# EAGLE schematic repeater_opto (EAGLE 8.4.1)
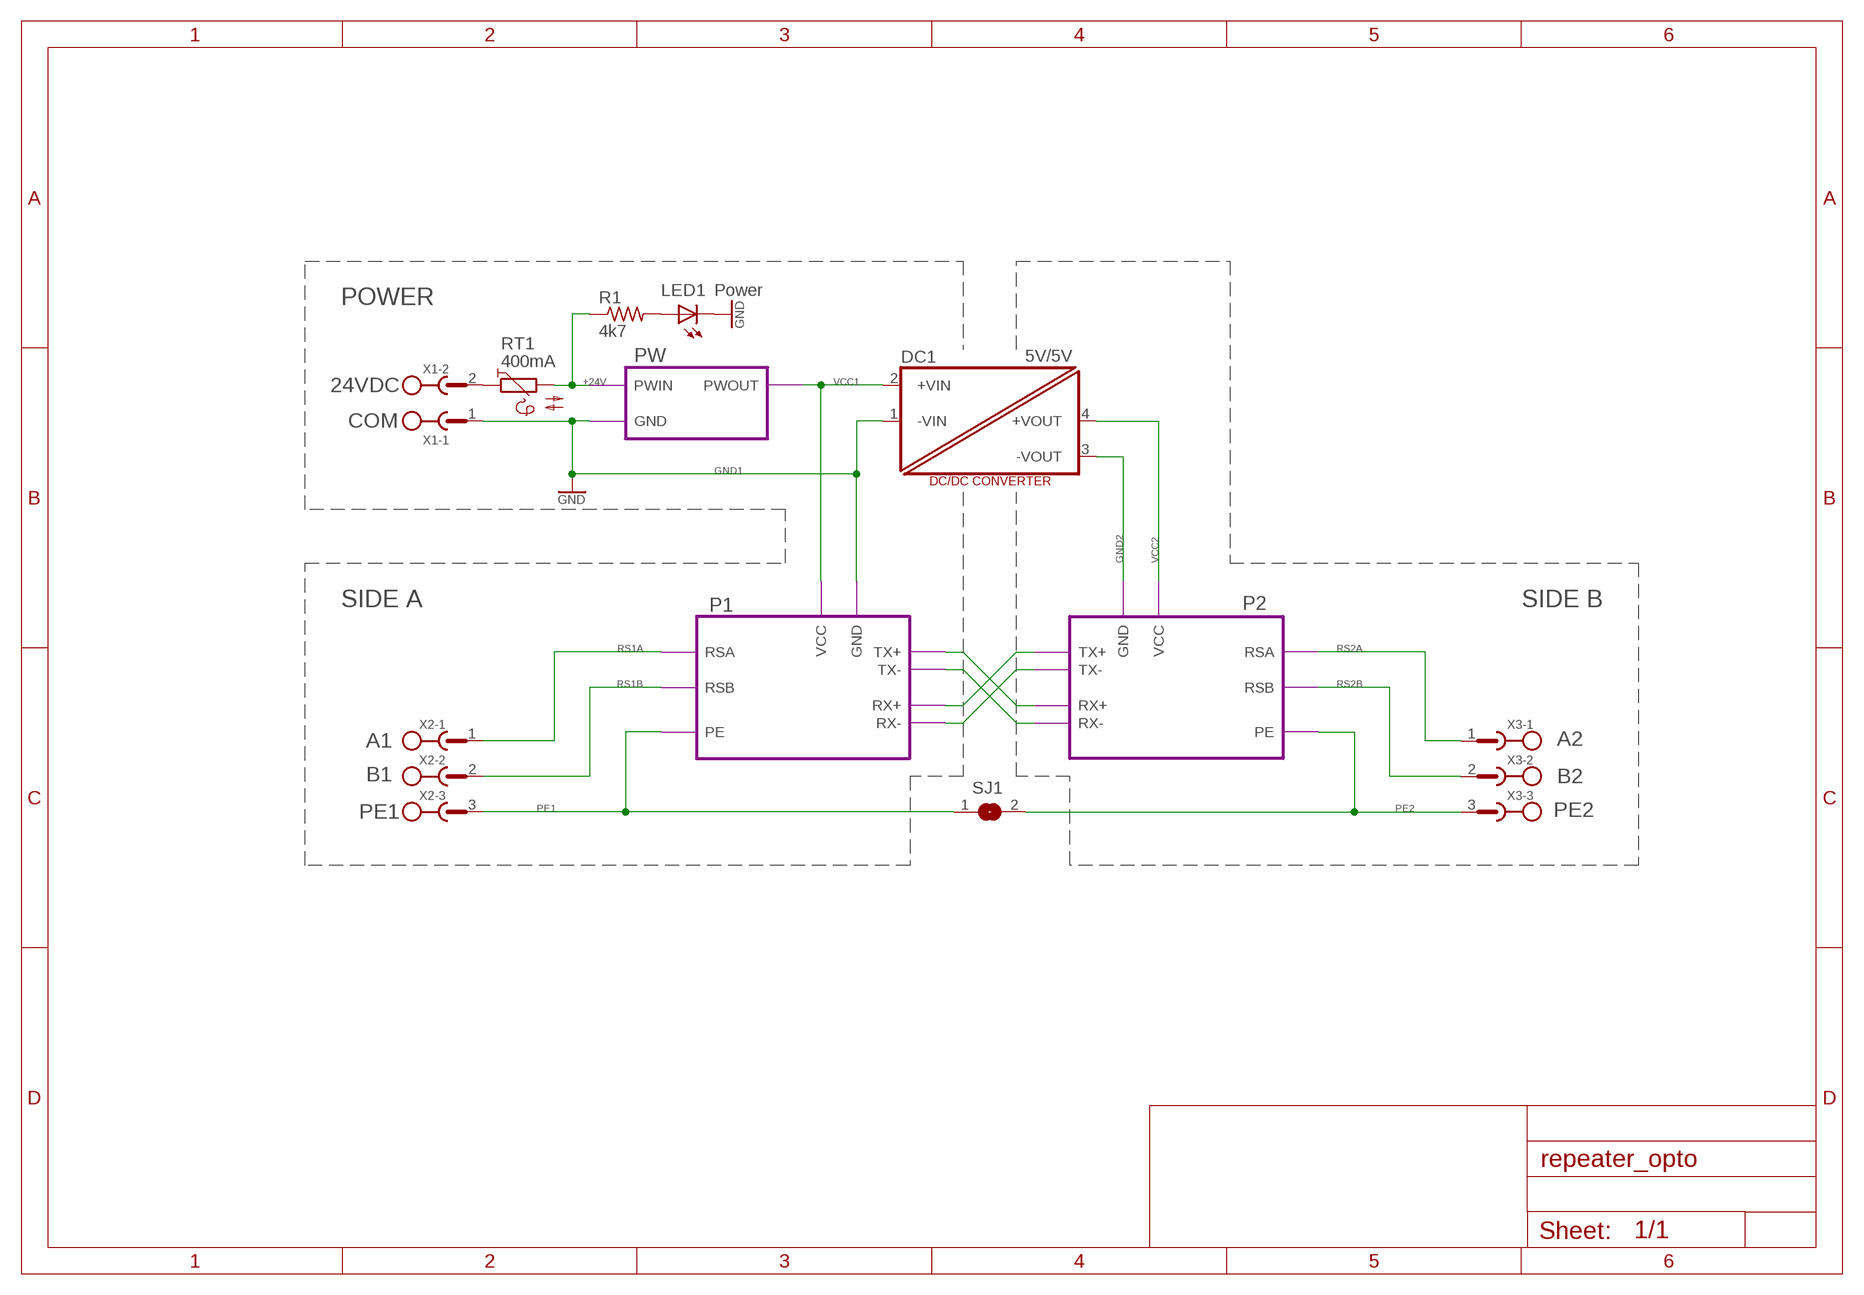
[diagram p0: schematic, sheet 1]

## Parts
DC1  5V/5V  NME  [NME]
LED1  Power  LED5MM  [LED5MM]
R1  4k7  R-US_R0805  [R0805]
RT1  400mA  PTC/X40  [X40]
SJ1  SJ-0  [SJ]
X1  POWER  MSTBA2  [MSTBA2]
X2  SIDE A  MSTBA3  [MSTBA3]
X3  SIDE B  MSTBA3  [MSTBA3]

## Module instances
P1 = RSP
P2 = RSP
PW = PW

## Nets
+24V [power]: R1.1 RT1.2 ; port PW.PWIN
GND1: DC1.1(-VIN) LED1.K(C) X1.1 ; port PW.GND P1.GND ; supply symbol labelled GND
GND2: DC1.3(-VOUT) ; port P2.GND
N$1: LED1.A R1.2
N$2 [power]: RT1.1 X1.2
N$12: port P1.TX+ P2.RX+
N$13: port P1.TX- P2.RX-
N$14: port P1.RX+ P2.TX+
N$15: port P1.RX- P2.TX-
PE1 [pe]: SJ1.1 X2.3 ; port P1.PE
PE2 [pe]: SJ1.2 X3.3 ; port P2.PE
RS1A: X2.1 ; port P1.RSA
RS1B: X2.2 ; port P1.RSB
RS2A: X3.1 ; port P2.RSA
RS2B: X3.2 ; port P2.RSB
VCC1 [power]: DC1.2(+VIN) ; port PW.PWOUT P1.VCC
VCC2 [power]: DC1.4(+VOUT) ; port P2.VCC

## Notes on the sheet
- 24VDC
- COM
- A1 | A2
- B1 | B2
- PE1 | PE2

## Library data of the parts
DC1 = dc-dc-converter:NME: DC-DC CONVERTER
LED1 = led:LED: LED OSRAM: - CHIPLED LG R971, LG N971, LY N971, LG Q971, LY Q971, LO R971, LY R971 LH N974, LH R974 LS Q976, LO Q976, LY Q976 LO Q996 - Hyper CHIPLED LW Q18S LB Q993, LB Q99A, LB R99A - SideLED LS A670, LO A670, LY A670, LG A670, LP A670 LB A673, LV A673, LT A673, LW A673 LH A674 LY A675 LS A676, LA A676, LO A676, LY A676, LW A676 LS A679, LY A679, LG A679 - Hyper Micro SIDELED® LS Y876, LA Y876, LO Y876, LY Y876 LT Y87S - SmartLED LW L88C, LW L88S LB L89C, LB L89S, LG L890 LS L89K, LO L89K, LY L89K LS L896, LA L896, LO L896, LY L896 - TOPLED LS T670, LO T670, LY T670, LG T670, LP T670 LSG T670, LSP T670, LSY T670, LOP T670, LYG T670 LG T671, LOG T671, LSG T671 LB T673, LV T673, LT T673, LW T673 LH T674 LS T676, LA T676, LO T676, LY T676, LB T676, LH T676, LSB T676, LW T676 LB T67C, LV T67C, LT T67C, LS T67K, LO T67K, LY T67K, LW E67C LS E67B, LA E67B, LO E67B, LY E67B, LB E67C, LV E67C, LT E67C LW T67C LS T679, LY T679, LG T679 LS T770, LO T770, LY T770, LG T770, LP T770 LB T773, LV T773, LT T773, LW T773 LH T774 LS E675, LA E675, LY E675, LS T675 LS T776, LA T776, LO T776, LY T776, LB T776 LHGB T686 LT T68C, LB T68C - Hyper Mini TOPLED® LB M676 - Mini TOPLED Santana® LG M470 LS M47K, LO M47K, LY M47K Source: http://www.osram.convergy.de LUXEON: - LUMILED® LXK2-PW12-R00, LXK2-PW12-S00, LXK2-PW14-U00, LXK2-PW14-V00 LXK2-PM12-R00, LXK2-PM12-S00, LXK2-PM14-U00 LXK2-PE12-Q00, LXK2-PE12-R00, LXK2-PE12-S00, LXK2-PE14-T00, LXK2-PE14-U00 LXK2-PB12-K00, LXK2-PB12-L00, LXK2-PB12-M00, LXK2-PB14-N00, LXK2-PB14-P00, LXK2-PB14-Q00 LXK2-PR12-L00, LXK2-PR12-M00, LXK2-PR14-Q00, LXK2-PR14-R00 LXK2-PD12-Q00, LXK2-PD12-R00, LXK2-PD12-S00 LXK2-PH12-R00, LXK2-PH12-S00 LXK2-PL12-P00, LXK2-PL12-Q00, LXK2-PL12-R00 Source: www.luxeon.com KINGBRIGHT: KA-3528ASYC Source: www.kingbright.com
R1 = rcl:R-US_: RESISTOR, American symbol
RT1 = descreet:PTC
SJ1 = jumper:SJ: SMD solder JUMPER
X1 = con-phoenix-508:MSTBA2: PHOENIX
X2 X3 = con-phoenix-508:MSTBA3: PHOENIX

## Module RSP
Ports: VCC(pwr) GND(pwr) RX+(in) RX-(in) TX+(out) TX-(out) RSB(io) RSA(io) PE(pas)
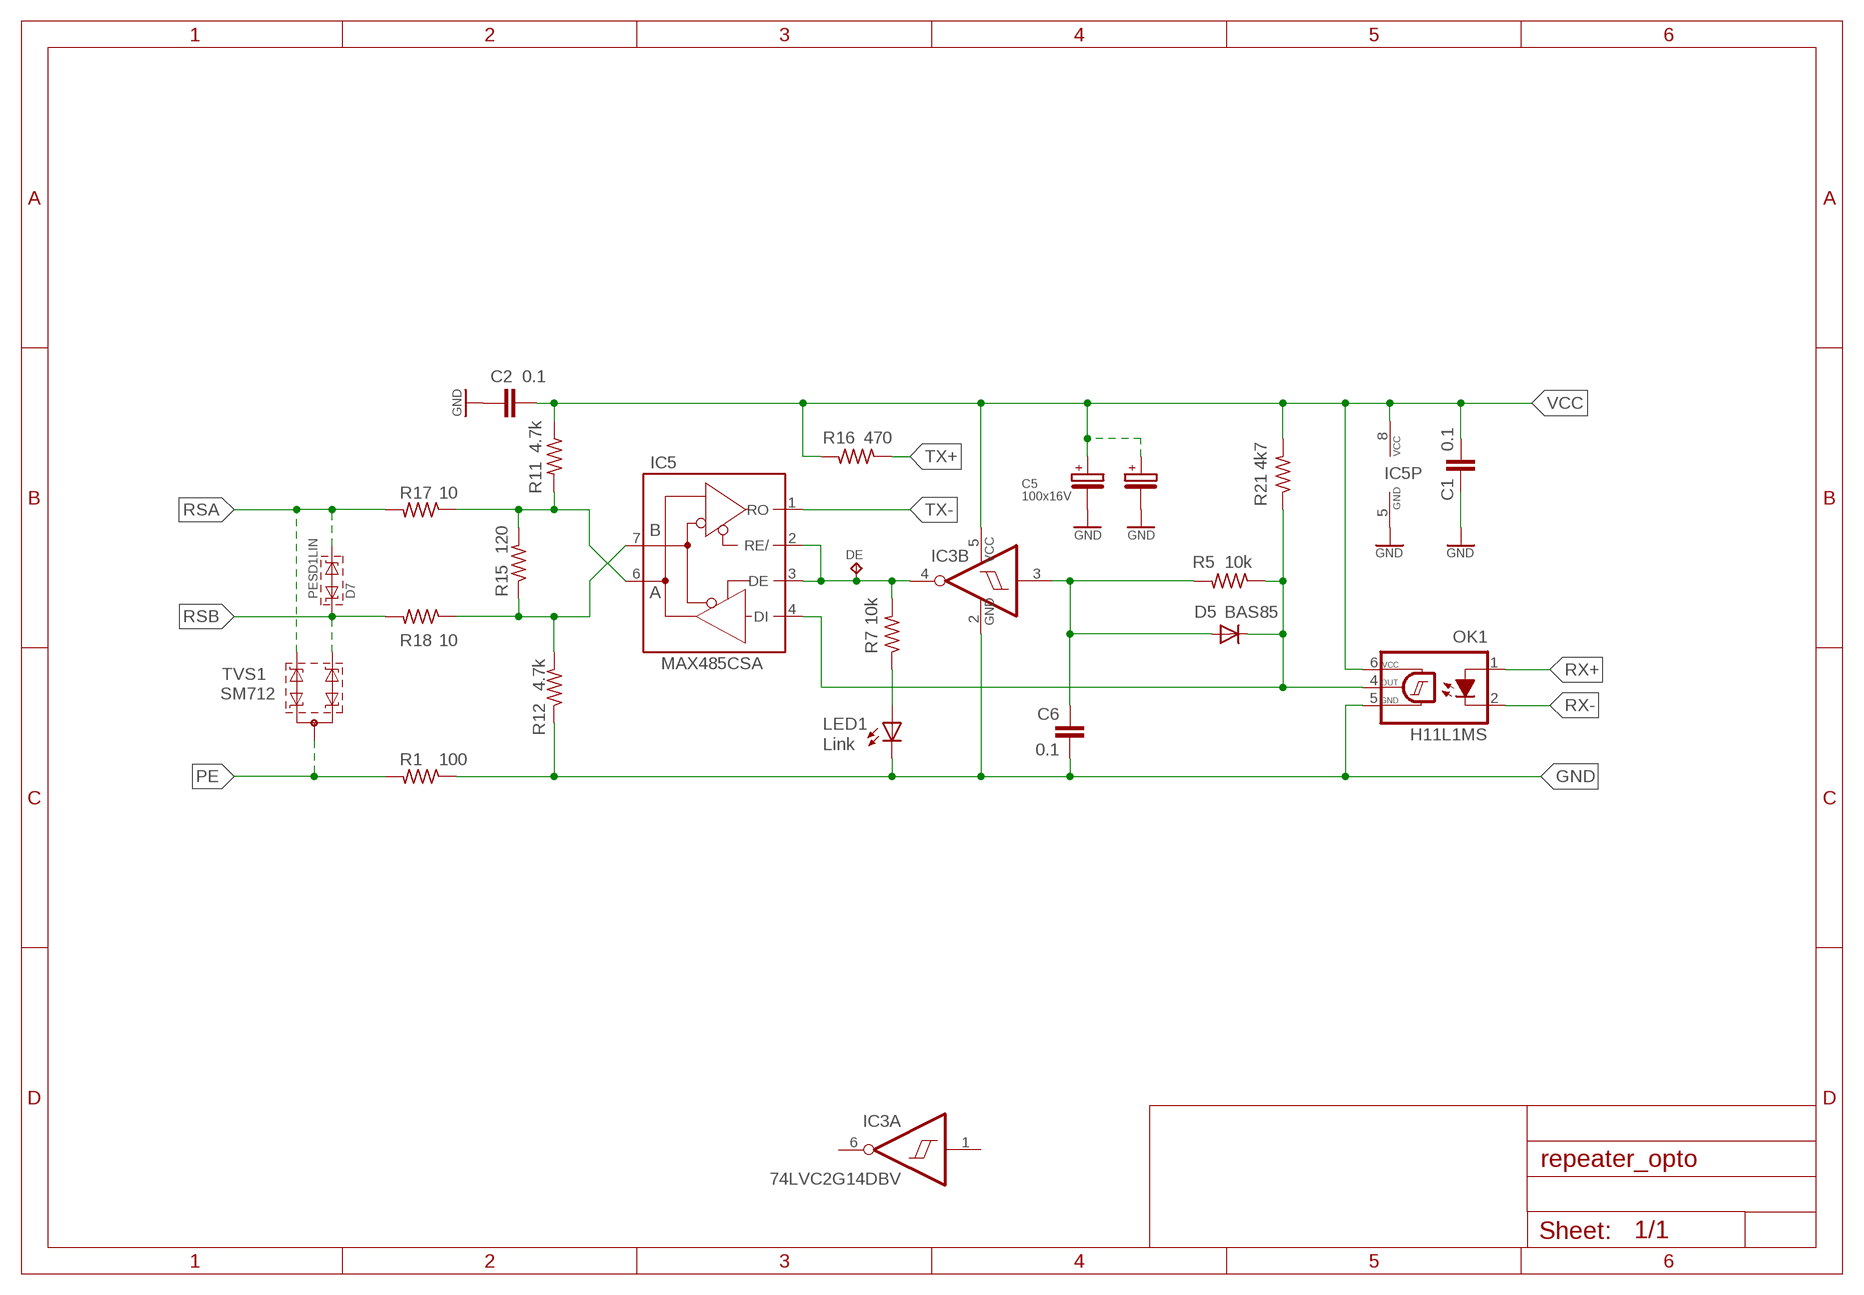
[diagram p1: schematic, module RSP, sheet 1]

### Parts
C1  0.1  C-EUC0805  [C0805]
C2  0.1  C-EUC0805  [C0805]
C5  100x16V  CPOL-EUSANYO_SMD_C6  [SANYO-OSCON_SMD_C6]
C6  0.1  C-EUC0805  [C0805]
C7  100x16V  CPOL-EUE2.5-6  [E2,5-6]
D5  BAS85  DIODE-MINIMELF  [MINIMELF]
D7  PESD1LIN  PESD5V0U1BA-R  [SOD323-R]
DE  TPB1,27  [B1,27]
IC3  74LVC2G14DBV  [SOT23-6]
IC5  MAX485CSA  [ESOP-8]
LED1  Link  LED5MM  [LED5MM]
OK1  H11L1MS  [DIL6-SMD]
R1  100  R-US_R1210  [R1210]
R5  10k  R-US_R0805  [R0805]
R7  10k  R-US_R0805  [R0805]
R11  4.7k  R-US_R0805  [R0805]
R12  4.7k  R-US_R0805  [R0805]
R15  120  R-US_R0805  [R0805]
R16  470  R-US_R0805  [R0805]
R17  10  R-US_R0805  [R0805]
R18  10  R-US_R0805  [R0805]
R21  4k7  R-US_R0805  [R0805]
TVS1  SM712  [SOT23]

### Nets
GND: C1.2 C2.2 C5.- C6.2 C7.- IC3.2(P:GND) IC5.5(GND) LED1.K(C) OK1.5(GND) R1.1 R12.1
LED+: DE.PP(TP) IC3.4(B:O) IC5.2(RE/) IC5.3(DE) R7.2
N$1: LED1.A R7.1
N$2: IC5.7(B) R12.2 R15.1 R18.1
N$3: IC5.6(A) R11.2 R15.2 R17.1
N$7: C6.1 D5.A IC3.3(B:I) R5.2
PE: R1.2 TVS1.3
RSA: D7.C(C2) R17.2 TVS1.2
RSB: D7.A(C1) R18.2 TVS1.1
RX: D5.C IC5.4(DI) OK1.4(OUT) R5.1 R21.1
RX+: OK1.1(A)
RX-: OK1.2(C)
TX+: R16.1
TX-: IC5.1(RO)
VCC [power]: C1.1 C2.1 C5.+ C7.+ IC3.5(P:VCC) IC5.8(VCC) OK1.6(VCC) R11.1 R16.2 R21.2
Unconnected: IC3.1(A:I) IC3.6(A:O)

### Library data of the parts
C1 C2 C6 = rcl:C-EU: CAPACITOR, European symbol
C5 C7 = rcl:CPOL-EU: POLARIZED CAPACITOR, European symbol; PRICE: 1.10
D5 = diode:DIODE-: DIODE
D7 = repeater:PESD5V0U1BA
DE = testpad:TP: Test pad
IC3 = repeater:74*14: Dual Schmitt-Trigger Inverter Gate
IC5 = linear:MAX48*?: RS485 TRANSEIVER; VENT_CODE: ZELM048
LED1 = led:LED: LED OSRAM: - CHIPLED LG R971, LG N971, LY N971, LG Q971, LY Q971, LO R971, LY R971 LH N974, LH R974 LS Q976, LO Q976, LY Q976 LO Q996 - Hyper CHIPLED LW Q18S LB Q993, LB Q99A, LB R99A - SideLED LS A670, LO A670, LY A670, LG A670, LP A670 LB A673, LV A673, LT A673, LW A673 LH A674 LY A675 LS A676, LA A676, LO A676, LY A676, LW A676 LS A679, LY A679, LG A679 - Hyper Micro SIDELED® LS Y876, LA Y876, LO Y876, LY Y876 LT Y87S - SmartLED LW L88C, LW L88S LB L89C, LB L89S, LG L890 LS L89K, LO L89K, LY L89K LS L896, LA L896, LO L896, LY L896 - TOPLED LS T670, LO T670, LY T670, LG T670, LP T670 LSG T670, LSP T670, LSY T670, LOP T670, LYG T670 LG T671, LOG T671, LSG T671 LB T673, LV T673, LT T673, LW T673 LH T674 LS T676, LA T676, LO T676, LY T676, LB T676, LH T676, LSB T676, LW T676 LB T67C, LV T67C, LT T67C, LS T67K, LO T67K, LY T67K, LW E67C LS E67B, LA E67B, LO E67B, LY E67B, LB E67C, LV E67C, LT E67C LW T67C LS T679, LY T679, LG T679 LS T770, LO T770, LY T770, LG T770, LP T770 LB T773, LV T773, LT T773, LW T773 LH T774 LS E675, LA E675, LY E675, LS T675 LS T776, LA T776, LO T776, LY T776, LB T776 LHGB T686 LT T68C, LB T68C - Hyper Mini TOPLED® LB M676 - Mini TOPLED Santana® LG M470 LS M47K, LO M47K, LY M47K Source: http://www.osram.convergy.de LUXEON: - LUMILED® LXK2-PW12-R00, LXK2-PW12-S00, LXK2-PW14-U00, LXK2-PW14-V00 LXK2-PM12-R00, LXK2-PM12-S00, LXK2-PM14-U00 LXK2-PE12-Q00, LXK2-PE12-R00, LXK2-PE12-S00, LXK2-PE14-T00, LXK2-PE14-U00 LXK2-PB12-K00, LXK2-PB12-L00, LXK2-PB12-M00, LXK2-PB14-N00, LXK2-PB14-P00, LXK2-PB14-Q00 LXK2-PR12-L00, LXK2-PR12-M00, LXK2-PR14-Q00, LXK2-PR14-R00 LXK2-PD12-Q00, LXK2-PD12-R00, LXK2-PD12-S00 LXK2-PH12-R00, LXK2-PH12-S00 LXK2-PL12-P00, LXK2-PL12-Q00, LXK2-PL12-R00 Source: www.luxeon.com KINGBRIGHT: KA-3528ASYC Source: www.kingbright.com
OK1 = optocoupler:H11L*M: 6-Pin DIP Optocoupler Source: http://www.fairchildsemi.com/ds/H1/H11L2-M.pdf
R1 R5 R7 R11 R12 R15-R18 R21 = rcl:R-US_: RESISTOR, American symbol
TVS1 = repeater:SM712

## Module PW
Ports: PWIN(pwr) GND(pwr) PWOUT(pwr)
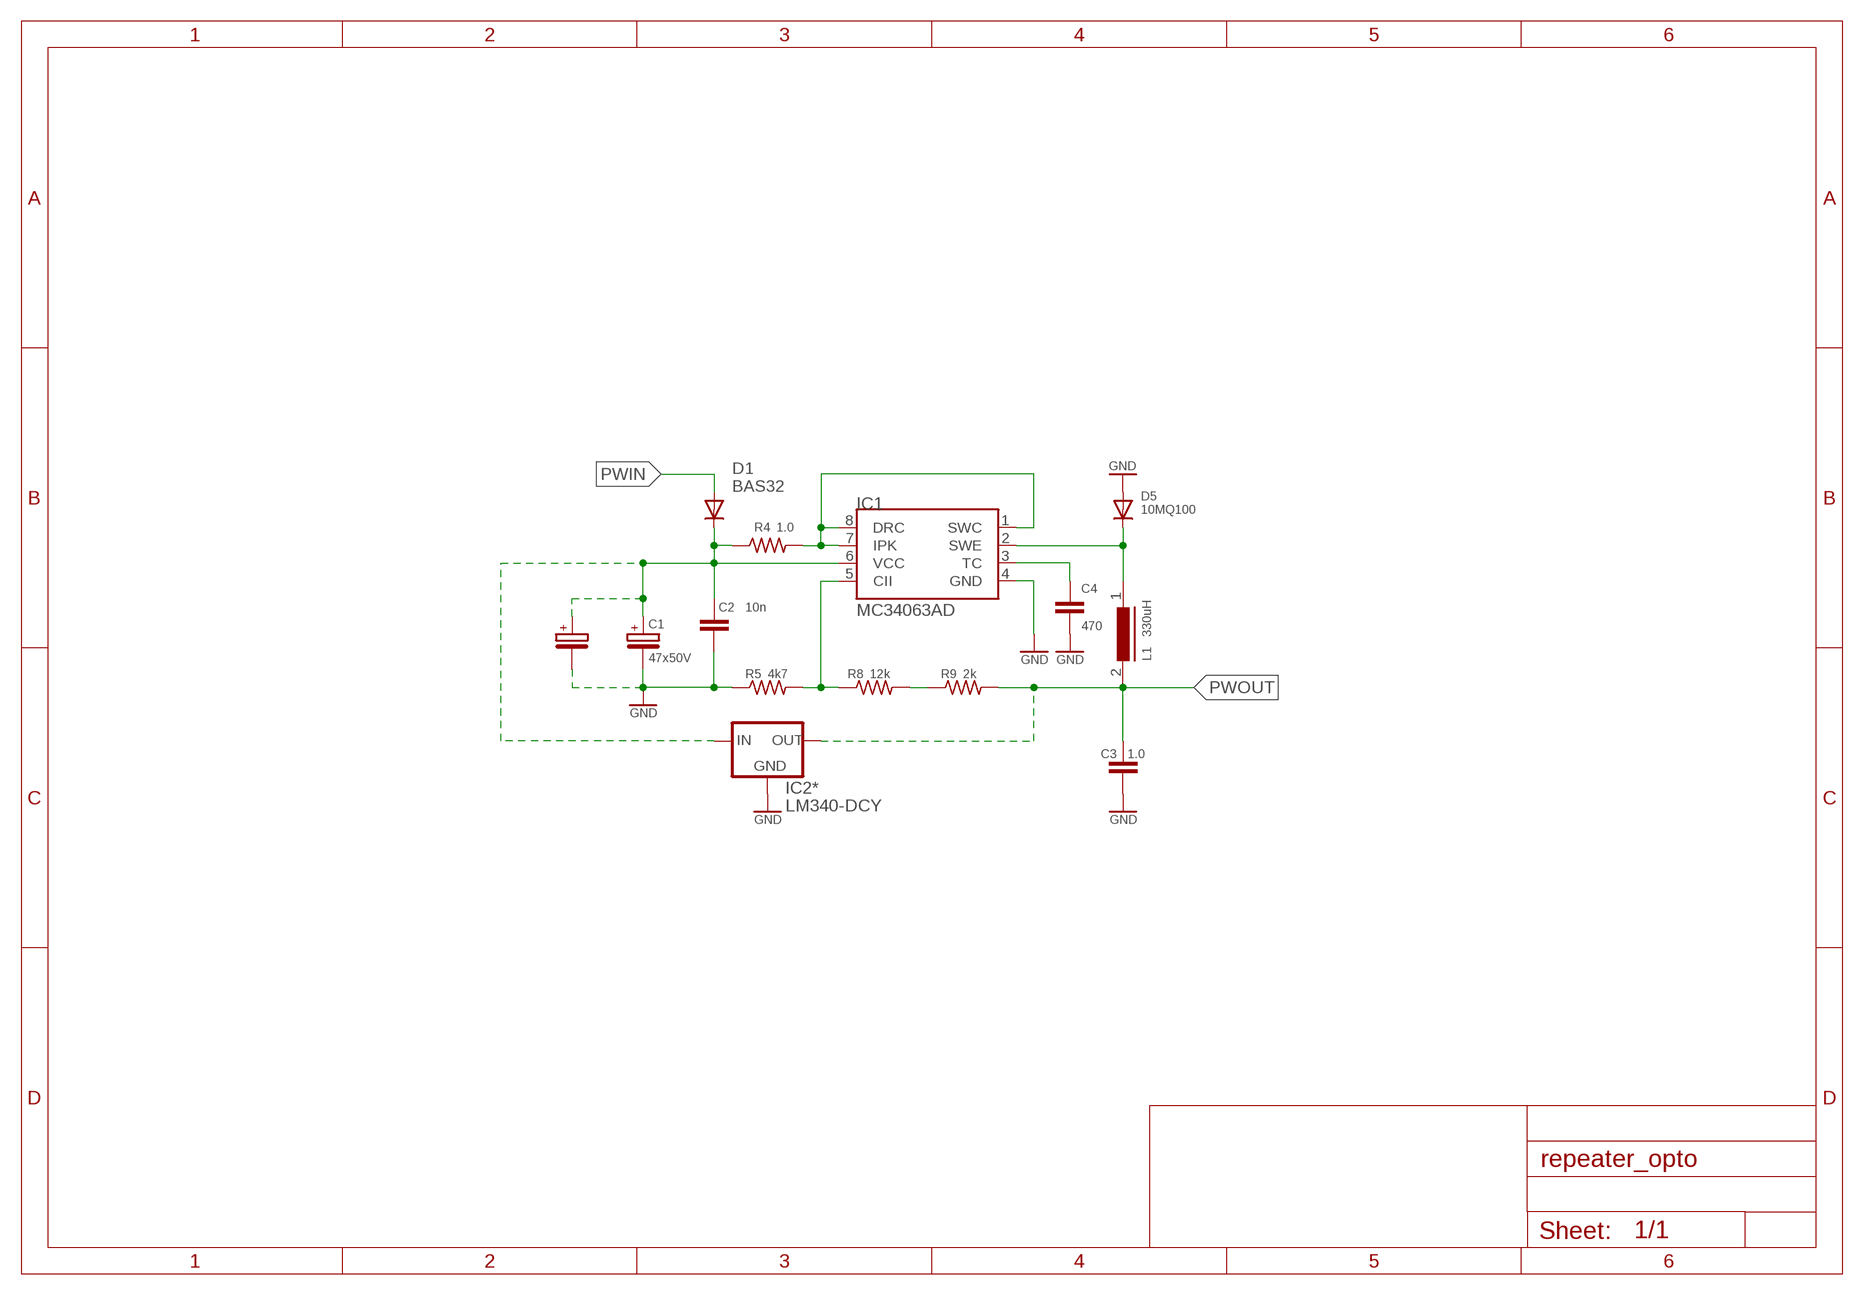
[diagram p2: schematic, module PW, sheet 1]

### Parts
C1  47x50V  CPOL-EUSANYO_SMD_C6  [SANYO-OSCON_SMD_C6]
C2  10n  C-EUC0805  [C0805]
C3  1.0  C-EUC1206  [C1206]
C4  470  C-EUC0805  [C0805]
C6  47x50V  CPOL-EUE2.5-6  [E2,5-6]
D1  BAS32  DIODE-MINIMELF  [MINIMELF]
D5  10MQ100  DIODE-DO214BA  [DO214BA]
IC1  MC34063AD  [SO08]
IC2*  LM340-DCY  LM340MP-5V-DCY  [SOT223]
L1  330uH  INDUCTOR_DR1030  [DR1030]
R4  1.0  R-US_R1206  [R1206]
R5  4k7  R-US_R0805  [R0805]
R8  12k  R-US_R0805  [R0805]
R9  2k  R-US_R0805  [R0805]

### Nets
GND: C1.- C2.2 C3.2 C4.2 C6.- D5.A IC1.4(GND) IC2*.2(GND) IC2*.4(GND) R5.1
N$2 [power]: C1.+ C2.1 C6.+ D1.C IC1.6(VCC) IC2*.1(IN) R4.1
N$29 [power]: IC1.1(SWC) IC1.7(IPK) IC1.8(DRC) R4.2
N$30: C4.1 IC1.3(TC)
N$33: R8.2 R9.1
N$34: IC1.5(CII) R5.2 R8.1
N$35 [power]: D5.C IC1.2(SWE) L1.1
PWIN [power]: D1.A
PWOUT [power]: C3.1 IC2*.3(OUT) L1.2 R9.2

### Library data of the parts
C1 C6 = rcl:CPOL-EU: POLARIZED CAPACITOR, European symbol; PRICE: 1.10
C2 = touch:C-EU: CAPACITOR, European symbol; NOM_NR: ZKN
C3 C4 = rcl:C-EU: CAPACITOR, European symbol; PRICE: 0.01
D1 D5 = diode:DIODE-: DIODE
IC1 = touch:MC34063; VENT_CODE: ZELM041
IC2* = touch:LM340*
L1 = touch:INDUCTOR_*: High Power Density, High Efficiency, Shielded Inductors Source: coiltronics_dr_series.pdf
R4 = touch:R-US_: RESISTOR, American symbol; NOM_NR: ZELRS019; PRICE: 0.02
R5 R8 R9 = rcl:R-US_: RESISTOR, American symbol; PRICE: 0.01

## Net classes
0 default: clearance 0.205 mm
1 power: clearance 0.305 mm to class 0, clearance 0.305 mm
2 pe: clearance 0.508 mm to class 0, clearance 0.508 mm to class 1, clearance 0.508 mm